# Altium project PCB_Project1.PrjPCB
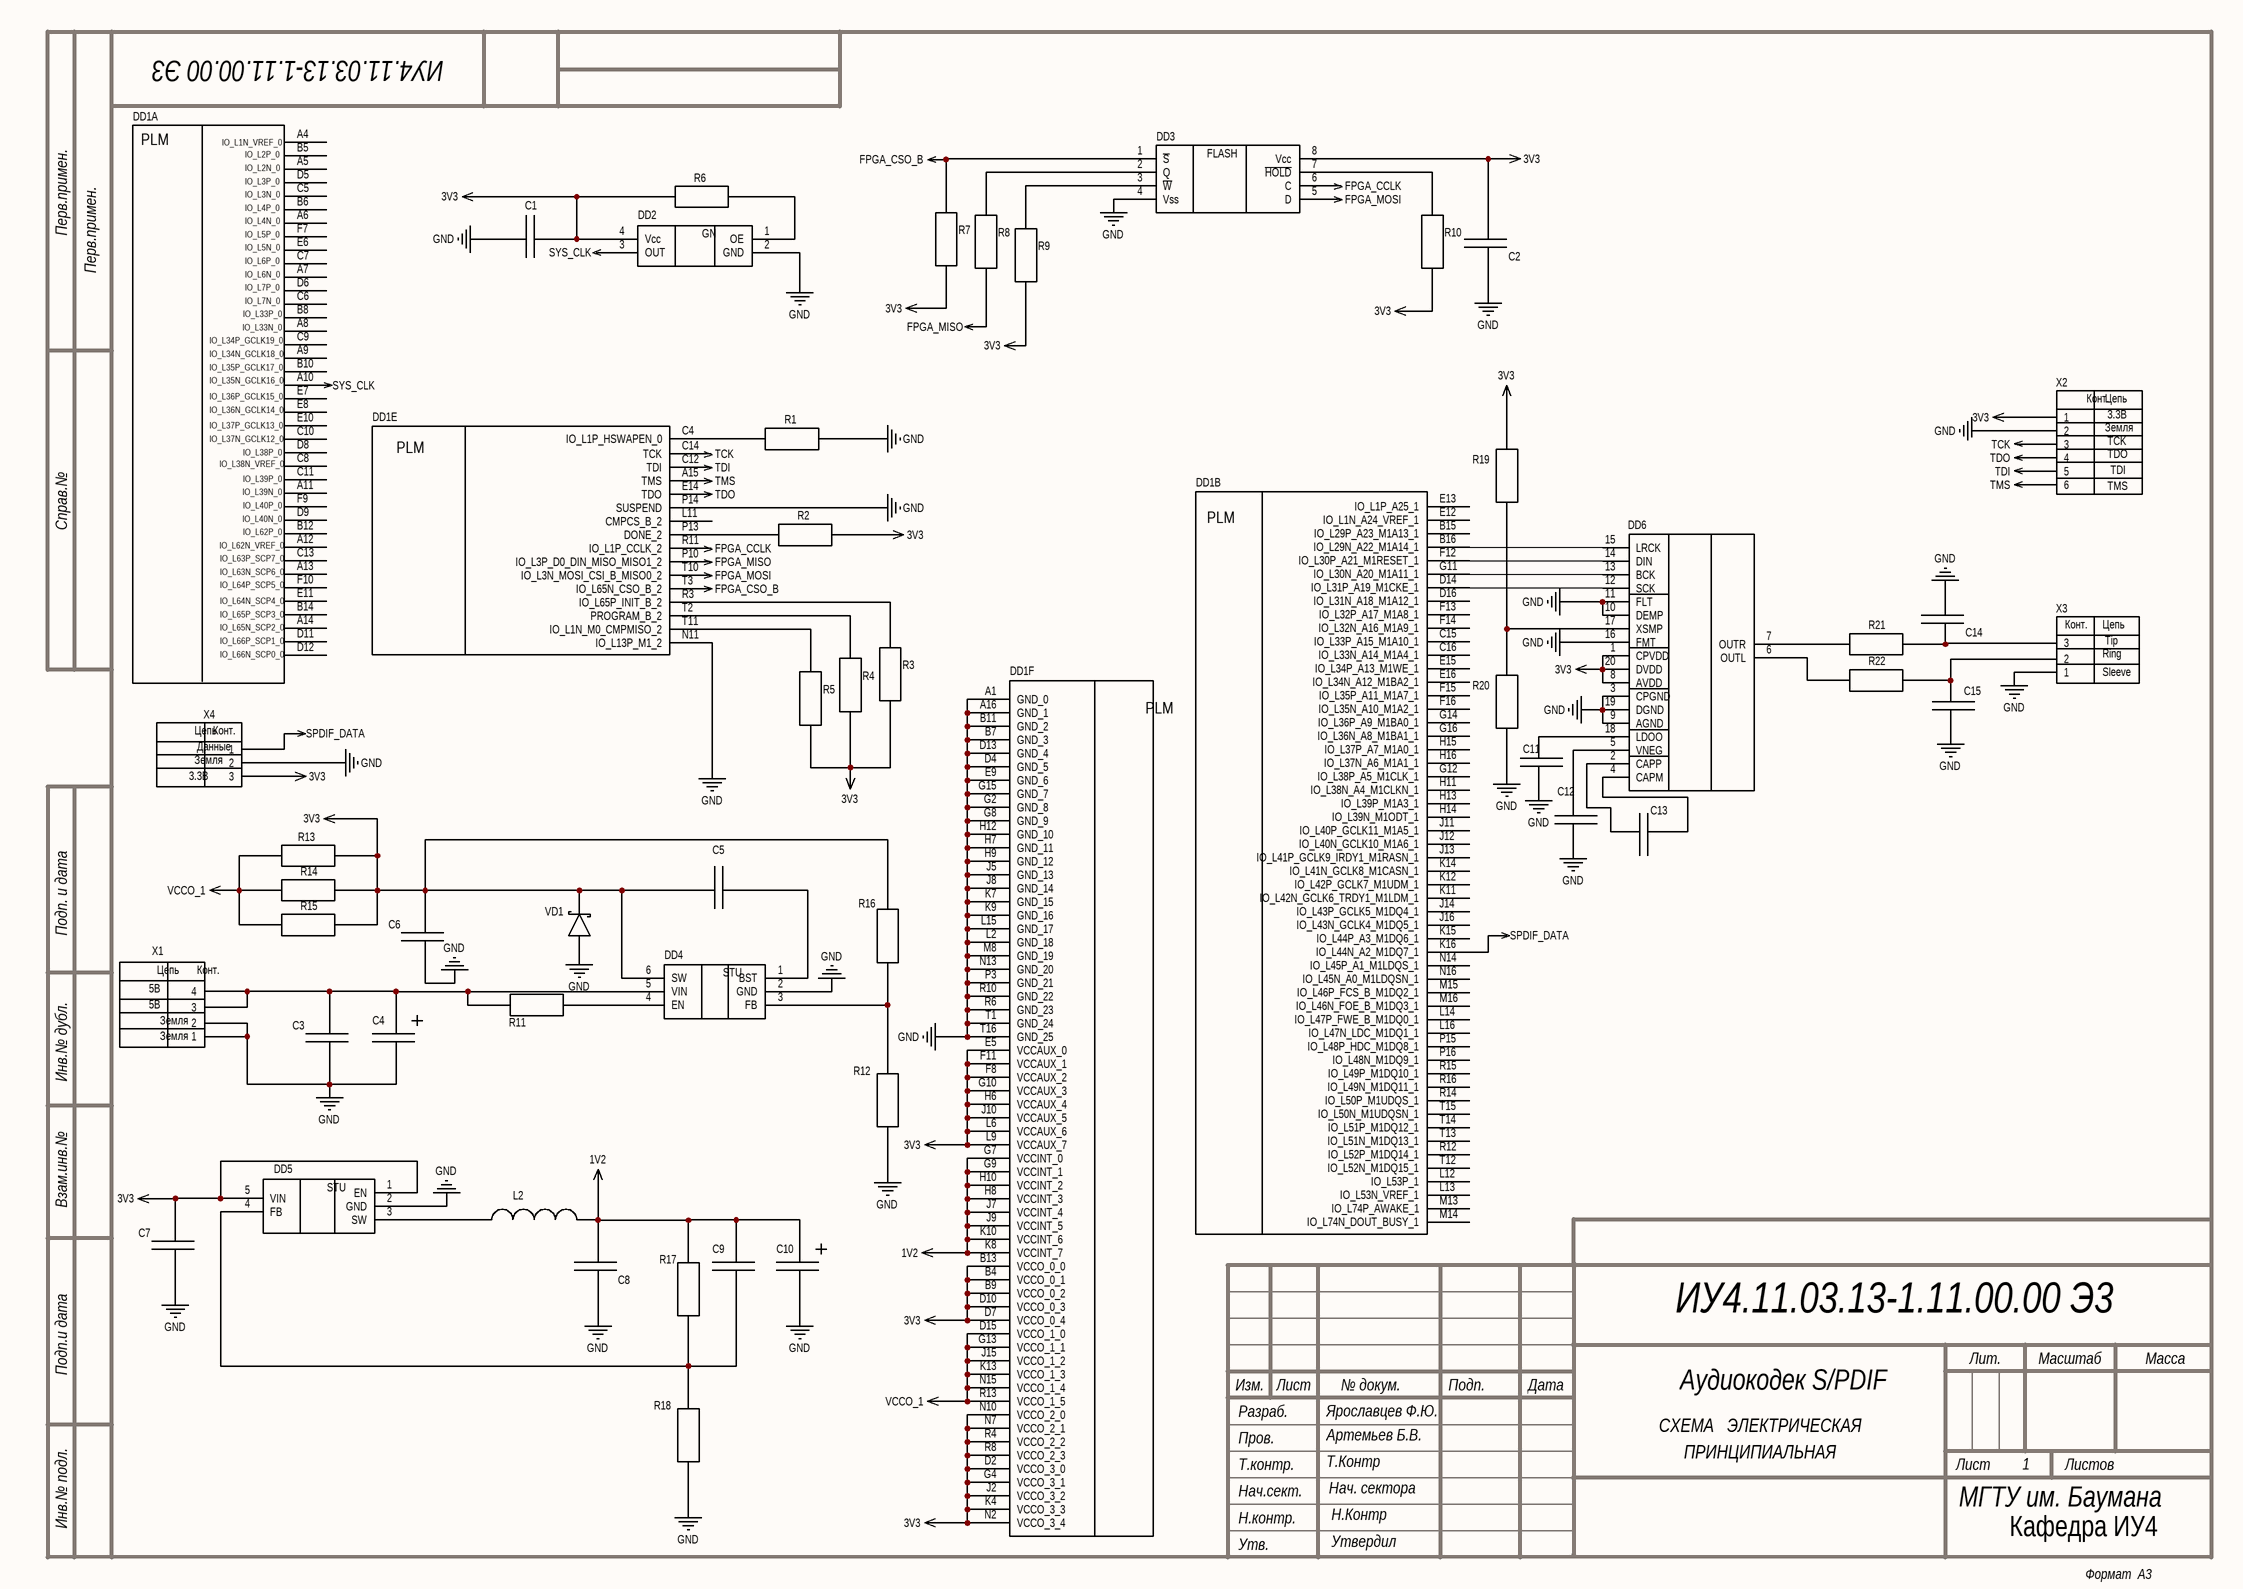
[diagram p0: Sheet1.SchDoc]
1 sheet, 49 parts. Net scope: flat (ports and power ports of the same name join across sheets).
Board file: PCB1.PcbDoc

## Sheet Sheet1.SchDoc: Наименование
size 420 x 297 mm; Weight: -; ScaleFactor: -; NormInspection: Норм.Контр.; ApprovedBy: Утвердил; CheckedBy: Артемьев Б.В.; Author: Ярославцев Ф.Ю.; CompanyName: МГТУ им. Баумана; DrawnBy: Н.Контр; Engineer: Т.Контр; SheetNumber: 1; SheetTotal: 1; PageSetup: Record=PageOptions|CenterHorizontal=True|CenterVertical=True|PrintScale=0.94|XCorrection=1.00|YCorrection=1.00|PrintKind=1|BorderSize=5000000|LeftOffset=0|BottomOffset=0|Orientation=1|PaperLength=1000|PaperWidth=1000|Scale=100|PaperSource=7|PrintQuality=-4|MediaType=1|DitherType=10|PaperKind=A4|PrintScaleMode=1; DecimalNumber: ИУ4.11.03.13-1.11.00.00 Э3; HeadOfSector: Нач. сектора; MainDevice: Перв.примен.; Name: Аудиокодек S/PDIF; DocumentName: Sheet1.SCHDOC

### Parts
C1  Capacitor  [SMD0805]  (value not drawn)
C2  Capacitor  [SMD0805]  (value not drawn)
C3  Capacitor  [SMD0805]  (value not drawn)
C4  SMD_ElectrolyticCap  [ElectrolitycCap]  (value not drawn)
C5  Capacitor  [SMD0805]  (value not drawn)
C6  Capacitor  [SMD0805]  (value not drawn)
C7  Capacitor  [SMD0805]  (value not drawn)
C8  Capacitor  [SMD0805]  (value not drawn)
C9  Capacitor  [SMD0805]  (value not drawn)
C10  SMD_ElectrolyticCap  [ElectrolitycCap]  (value not drawn)
C11  Capacitor  [SMD0805]  (value not drawn)
C12  Capacitor  [SMD0805]  (value not drawn)
C13  Capacitor  [SMD0805]  (value not drawn)
C14  Capacitor  [SMD0805]  (value not drawn)
C15  Capacitor  [SMD0805]  (value not drawn)
DD1  Spartan-6  [FTG256]  (value not drawn)  (parts A,B,E,F of 6)
DD2  SG-8002JC-50  [SOJ4]  (value not drawn)
DD3  M25P80  [STSO-8]  (value not drawn)
DD4  MP2359  [SOP6]  (value not drawn)
DD5  NCP1529  [PCBComponent_1 - duplicate1]  (value not drawn)
DD6  PCM5102A  [PW(R-PDSO-G20)]  (value not drawn)
L2  Inductance  [InductorSMD]  (value not drawn)
R1  SMD_Resistor  [Resistor]  (value not drawn)
R2  SMD_Resistor  [Resistor]  (value not drawn)
R3  SMD_Resistor  [Resistor]  (value not drawn)
R4  SMD_Resistor  [Resistor]  (value not drawn)
R5  SMD_Resistor  [Resistor]  (value not drawn)
R6  SMD_Resistor  [Resistor]  (value not drawn)
R7  SMD_Resistor  [Resistor]  (value not drawn)
R8  SMD_Resistor  [Resistor]  (value not drawn)
R9  SMD_Resistor  [Resistor]  (value not drawn)
R10  SMD_Resistor  [Resistor]  (value not drawn)
R11  SMD_Resistor  [Resistor]  (value not drawn)
R12  SMD_Resistor  [Resistor]  (value not drawn)
R13  SMD_Resistor  [Resistor]  (value not drawn)
R14  SMD_Resistor  [Resistor]  (value not drawn)
R15  SMD_Resistor  [Resistor]  (value not drawn)
R16  SMD_Resistor  [Resistor]  (value not drawn)
R17  SMD_Resistor  [Resistor]  (value not drawn)
R18  SMD_Resistor  [Resistor]  (value not drawn)
R19  SMD_Resistor  [Resistor]  (value not drawn)
R20  SMD_Resistor  [Resistor]  (value not drawn)
R21  SMD_Resistor  [Resistor]  (value not drawn)
R22  SMD_Resistor  [Resistor]  (value not drawn)
VD1  1N5819HW  [SOD123]  (value not drawn)
X1  PowerJack3.5mm  [PowerJackConnector4pin]  (value not drawn)
X2  6x2.54Connector  [6PINConnector2.54]  (value not drawn)
X3  CUI SJ1-3513-SMT-TR  [StereoJack3.5]  (value not drawn)
X4  TORX1355  [SPDIF]  (value not drawn)

### Ports
FPGA_CCLK, FPGA_CSO_B, FPGA_MISO, FPGA_MOSI, SPDIF_DATA, SYS_CLK, TCK, TDI, TDO, TMS

### Nets
1V2: C8.1 C9.1 C10.1 DD1.G7(VCCINT_0) DD1.G9(VCCINT_1) DD1.H8(VCCINT_3) DD1.H10(VCCINT_2) DD1.J7(VCCINT_4) DD1.J9(VCCINT_5) DD1.K8(VCCINT_7) DD1.K10(VCCINT_6) L2.2 R17.1
3V3: C1.1 C2.1 C5.2 C6.1 C7.1 DD1.B4(VCCO_0_1) DD1.B9(VCCO_0_2) DD1.B13(VCCO_0_0) DD1.D2(VCCO_3_0) DD1.D7(VCCO_0_4) DD1.D10(VCCO_0_3) DD1.E5(VCCAUX_0) DD1.F8(VCCAUX_2) DD1.F11(VCCAUX_1) DD1.G4(VCCO_3_1) DD1.G10(VCCAUX_3) DD1.H6(VCCAUX_4) DD1.J2(VCCO_3_2) DD1.J10(VCCAUX_5) DD1.K4(VCCO_3_3) DD1.L6(VCCAUX_6) DD1.L9(VCCAUX_7) DD1.N2(VCCO_3_4) DD1.N7(VCCO_2_1) DD1.N10(VCCO_2_0) DD1.R4(VCCO_2_2) DD1.R8(VCCO_2_3) DD2.4(Vcc) DD3.8(Vcc) DD4.6(SW) DD5.1(EN) DD5.5(VIN) DD6.1(CPVDD) DD6.8(AVDD) DD6.20(DVDD) R2.2 R3.1 R4.1 R5.1 R6.1 R7.1 R9.1 R10.1 R13.1 R14.1 R15.1 R16.2 R19.1 VD1.1 X2.1 X4.3
GND: C1.2 C2.2 C3.2 C4.2 C6.2 C7.2 C8.2 C10.2 C11.1 C12.1 C14.1 C15.1 DD1.A1(GND_0) DD1.A16(GND_1) DD1.B7(GND_3) DD1.B11(GND_2) DD1.D4(GND_5) DD1.D13(GND_4) DD1.E9(GND_6) DD1.G2(GND_8) DD1.G8(GND_9) DD1.G15(GND_7) DD1.H7(GND_11) DD1.H9(GND_12) DD1.H12(GND_10) DD1.J5(GND_13) DD1.J8(GND_14) DD1.K7(GND_15) DD1.K9(GND_16) DD1.L2(GND_18) DD1.L15(GND_17) DD1.M8(GND_19) DD1.N11(IO_L13P_M1_2) DD1.N13(GND_20) DD1.P3(GND_21) DD1.P14(SUSPEND) DD1.R6(GND_23) DD1.R10(GND_22) DD1.T1(GND_24) DD1.T16(GND_25) DD2.2(GND) DD3.4(Vss) DD4.2(GND) DD5.2(GND) DD6.3(CPGND) DD6.9(AGND) DD6.10(DEMP) DD6.11(FLT) DD6.16(FMT) DD6.19(DGND) R1.2 R12.1 R18.1 R20.2 VD1.2 X1.1 X1.2 X2.2 X3.1 X4.2
VCCO_1: DD1.D15(VCCO_1_0) DD1.G13(VCCO_1_1) DD1.J15(VCCO_1_2) DD1.K13(VCCO_1_3) DD1.N15(VCCO_1_4) DD1.R13(VCCO_1_5) R13.2 R14.2 R15.2
NetC3_1: C3.1 C4.1 DD4.5(VIN) R11.2 X1.3 X1.4
NetC5_1: C5.1 DD4.1(BST)
NetC9_2: C9.2 DD5.4(FB) R17.2 R18.2
NetC11_2: C11.2 DD6.18(LDOO)
NetC12_2: C12.2 DD6.5(VNEG)
NetC13_1: C13.1 DD6.2(CAPP)
NetC13_2: C13.2 DD6.4(CAPM)
NetC14_2: C14.2 R21.2 X3.3
NetC15_2: C15.2 R22.2 X3.2
NetDD1_A10: DD1.A10 DD2.3(OUT) ; port SYS_CLK
NetDD1_A15: DD1.A15(TMS) X2.6 ; port TMS
NetDD1_B16: DD1.B16(IO_L29N_A22_M1A14_1) DD6.15(LRCK)
NetDD1_C4: DD1.C4(IO_L1P_HSWAPEN_0) R1.1
NetDD1_C12: DD1.C12(TDI) X2.5 ; port TDI
NetDD1_C14: DD1.C14(TCK) X2.3 ; port TCK
NetDD1_D14: DD1.D14(IO_L31P_A19_M1CKE_1) DD6.12(SCK)
NetDD1_E14: DD1.E14(TDO) X2.4 ; port TDO
NetDD1_F12: DD1.F12(IO_L30P_A21_M1RESET_1) DD6.14(DIN)
NetDD1_G11: DD1.G11(IO_L30N_A20_M1A11_1) DD6.13(BCK)
NetDD1_K16: DD1.K16(IO_L44N_A2_M1DQ7_1) X4.1 ; port SPDIF_DATA
NetDD1_P10: DD1.P10(IO_L3P_D0_DIN_MISO_MISO1_2) R8.1 ; port FPGA_MISO
NetDD1_P13: DD1.P13(DONE_2) R2.1
NetDD1_R3: DD1.R3(IO_L65P_INIT_B_2) R3.2
NetDD1_R11: DD1.R11(IO_L1P_CCLK_2) DD3.6(C) ; port FPGA_CCLK
NetDD1_T2: DD1.T2(PROGRAM_B_2) R4.2
NetDD1_T3: DD1.T3(IO_L65N_CSO_B_2) DD3.1(~{S}) R7.2 ; port FPGA_CSO_B
NetDD1_T10: DD1.T10(IO_L3N_MOSI_CSI_B_MISO0_2) DD3.5(D) ; port FPGA_MOSI
NetDD1_T11: DD1.T11(IO_L1N_M0_CMPMISO_2) R5.2
NetDD2_1: DD2.1(OE) R6.2
NetDD3_2: DD3.2(Q) R8.2
NetDD3_3: DD3.3(~{W}) R9.2
NetDD3_7: DD3.7(~{HOLD}) R10.2
NetDD4_3: DD4.3(FB) R12.2 R16.1
NetDD4_4: DD4.4(EN) R11.1
NetDD5_3: DD5.3(SW) L2.1
NetDD6_6: DD6.6(OUTL) R22.1
NetDD6_7: DD6.7(OUTR) R21.1
NetDD6_17: DD6.17(XSMP) R19.2 R20.1

Not connected (* = marked no-connect by the designer): DD1 A4 A5 A6 A7 A8 A9 A11 A12 A13 A14 B5 B6 B8 B10 B12 B14 B15(IO_L29P_A23_M1A13_1) C5 C6 C7 C8 C9 C10 C11 C13 C15(IO_L33P_A15_M1A10_1) C16(IO_L33N_A14_M1A4_1) D5 D6 D8 D9 D11 D12 D16(IO_L31N_A18_M1A12_1) E6 E7 E8 E10 E11 E12(IO_L1N_A24_VREF_1) E13(IO_L1P_A25_1) E15(IO_L34P_A13_M1WE_1) E16(IO_L34N_A12_M1BA2_1) F7 F9 F10 F13(IO_L32P_A17_M1A8_1) F14(IO_L32N_A16_M1A9_1) F15(IO_L35P_A11_M1A7_1) F16(IO_L35N_A10_M1A2_1) G12(IO_L38P_A5_M1CLK_1) G14(IO_L36P_A9_M1BA0_1) G16(IO_L36N_A8_M1BA1_1) H11(IO_L38N_A4_M1CLKN_1) H13(IO_L39P_M1A3_1) H14(IO_L39N_M1ODT_1) H15(IO_L37P_A7_M1A0_1) H16(IO_L37N_A6_M1A1_1) J11(IO_L40P_GCLK11_M1A5_1) J12(IO_L40N_GCLK10_M1A6_1) J13(IO_L41P_GCLK9_IRDY1_M1RASN_1) J14(IO_L43P_GCLK5_M1DQ4_1) J16(IO_L43N_GCLK4_M1DQ5_1) K11(IO_L42N_GCLK6_TRDY1_M1LDM_1) K12(IO_L42P_GCLK7_M1UDM_1) K14(IO_L41N_GCLK8_M1CASN_1) K15(IO_L44P_A3_M1DQ6_1) L11(CMPCS_B_2) L12(IO_L53P_1) L13(IO_L53N_VREF_1) L14(IO_L47P_FWE_B_M1DQ0_1) L16(IO_L47N_LDC_M1DQ1_1) M13(IO_L74P_AWAKE_1) M14(IO_L74N_DOUT_BUSY_1) M15(IO_L46P_FCS_B_M1DQ2_1) M16(IO_L46N_FOE_B_M1DQ3_1) N14(IO_L45P_A1_M1LDQS_1) N16(IO_L45N_A0_M1LDQSN_1) P15(IO_L48P_HDC_M1DQ8_1) P16(IO_L48N_M1DQ9_1) R12(IO_L52P_M1DQ14_1) R14(IO_L50P_M1UDQS_1) R15(IO_L49P_M1DQ10_1) R16(IO_L49N_M1DQ11_1) T12(IO_L52N_M1DQ15_1) T13(IO_L51N_M1DQ13_1) T14(IO_L51P_M1DQ12_1) T15(IO_L50N_M1UDQSN_1)

### Notes on the sheet
- (near X2) Цепь
- (near X2) Земля
- (near X2) 3.3В
- (near X2) TCK
- (near X2) TDO
- (near X2) TMS
- (near X2) TDI
- (near X3) Цепь
- (near X3) Ring
- (near X3) Tip
- (near X4) Цепь
- (near X3) Sleeve
- (near X4) 3.3В
- (near X4) Земля
- (near X4) Данные
- 5В
- (near X1) Цепь
- (near X1) Земля
- Кафедра ИУ4
- Перв.примен.
- Справ.№
- Подп. и дата
- Инв.№ дубл.
- Взам.инв.№
- Подп.и дата
- Разраб.
- Изм.
- Лист
- № докум.
- Подп.
- Дата
- Лит.
- Масштаб
- Масса
- Т.контр.
- Пров.
- СХЕМА   ЭЛЕКТРИЧЕСКАЯ
- ПРИНЦИПИАЛЬНАЯ
- Листов
- Инв.№ подл.
- Утв.
- Н.контр.
- Нач.сект.
- Формат  A3
- (in symbol 6x2.54Connector) Конт.
- (in symbol CUI SJ1-3513-SMT-TR) Конт.
- (in symbol M25P80) FLASH
- (in symbol MP2359) STU
- (in symbol NCP1529) STU
- (in symbol PowerJack3.5mm) Конт.
- (in symbol SG-8002JC-50) GN
- (in symbol TORX1355) Конт.
- (in symbol XC6SLX16-2FTG256C, part A) IO_L1N_VREF_0; PLM; IO_L2P_0; IO_L2N_0; IO_L3P_0; IO_L3N_0; IO_L4P_0; IO_L4N_0; IO_L5P_0; IO_L5N_0; IO_L6P_0; IO_L6N_0; IO_L7P_0; IO_L7N_0; IO_L33P_0; IO_L33N_0; IO_L34P_GCLK19_0; IO_L34N_GCLK18_0; IO_L35P_GCLK17_0; IO_L35N_GCLK16_0; IO_L36P_GCLK15_0; IO_L36N_GCLK14_0; IO_L37P_GCLK13_0; IO_L37N_GCLK12_0; IO_L38P_0; IO_L38N_VREF_0; IO_L39P_0; IO_L39N_0; IO_L40P_0; IO_L40N_0; IO_L62P_0; IO_L62N_VREF_0; IO_L63P_SCP7_0; IO_L63N_SCP6_0; IO_L64P_SCP5_0; IO_L64N_SCP4_0; IO_L65P_SCP3_0; IO_L65N_SCP2_0; IO_L66P_SCP1_0; IO_L66N_SCP0_0
- (in symbol XC6SLX16-2FTG256C, part B) PLM
- (in symbol XC6SLX16-2FTG256C, part E) PLM
- (in symbol XC6SLX16-2FTG256C, part F) PLM

### Library data of the parts
C1-C3 C5-C9 C11-C15 = SMD_Cap: C1825C104JBGACTU - Kemet
  C1: Manufacturer: *; Value: *
C4 C10 = SMD_ElectrolyticCap: EEV-EB2W4R7SQ
DD1 = XC6SLX16-2FTG256C
DD2 = SG-8002JC-50: Oscillator 50 MHz 3.3V smd
DD3 = M25P80: Flash memory SPI
DD4 = MP2359: step-down switch converter TSOT-23-6
DD5 = NCP1529: Step-down / Converter TSOP−5
DD6 = PCM5102A: I2S DAC
R1-R22 = SMD_Resistor: SMD resistor
VD1 = 1N5819HW: Didode Schottky
X2 = 6x2.54Connector: JTAG connect on PCB
X3 = CUI SJ1-3513-SMT-TR: Stereo Jack 3.5 CUI SJ1-3513-SMT-TR